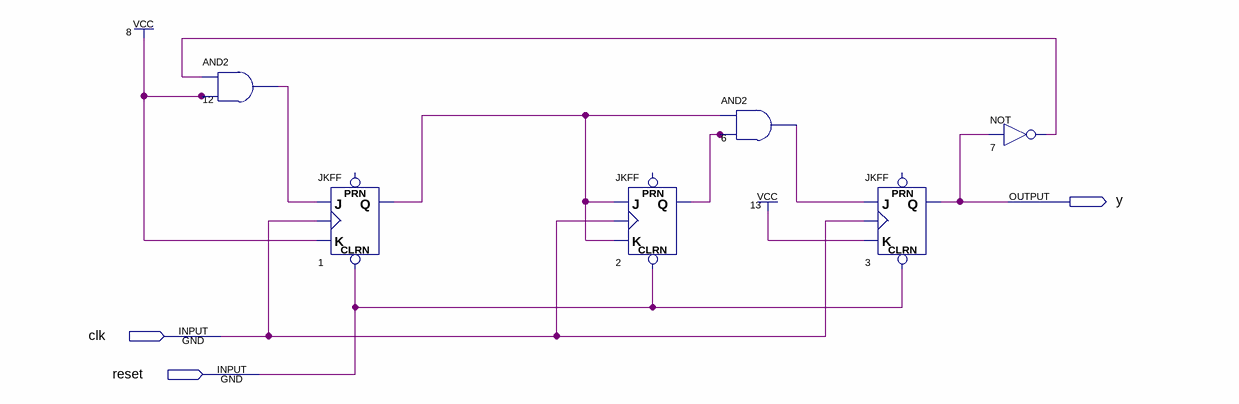
[diagram p0: schematic sheet]
// Quartus schematic count5_9des.bdf as structural Verilog: 6 symbols, 3 pins
module count5_9des (
  input  clk,
  input  reset,
  output y
);

  wire n1_q, n2_q, n6_out, n7_out, n12_out;

  and u_12 (n12_out, n7_out, 1'b1);
  JKFF u_1 (.CLRN(reset), .K(1'b1), .J(n12_out), .CLK(clk), .Q(n1_q));  // open: PRN
  JKFF u_2 (.CLRN(reset), .K(n1_q), .J(n1_q), .CLK(clk), .Q(n2_q));  // open: PRN
  and u_6 (n6_out, n1_q, n2_q);
  JKFF u_3 (.CLRN(reset), .K(1'b1), .J(n6_out), .CLK(clk), .Q(y));  // open: PRN
  not u_7 (n7_out, y);
endmodule
